# Altium schematic sheet NAND_Flash.SchDoc
size A4; SheetNumber: 3; SheetTotal: 7
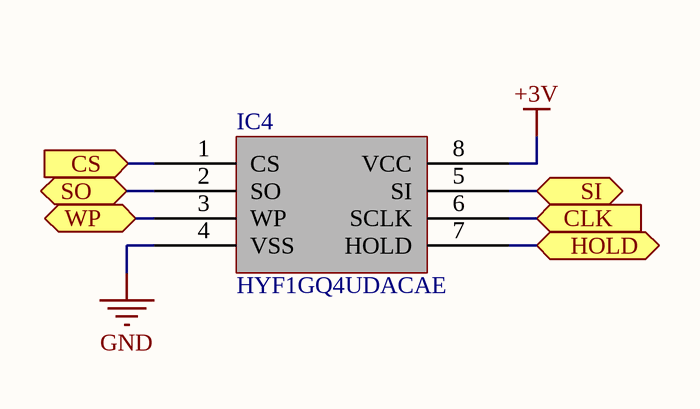
[diagram p0: NAND_Flash.SchDoc]

## Parts
IC4  HYF1GQ4UDACAE  [HeYangTek WSON-8-EP]

## Ports
CLK (in), CS (in), HOLD (bidir), SI (bidir), SO (bidir), WP (bidir)

## Nets
+3V: IC4.8(VCC)
GND: IC4.4(VSS)
CLK: IC4.6(SCLK) ; port CLK
CS: IC4.1(CS) ; port CS
HOLD: IC4.7(HOLD) ; port HOLD
SI: IC4.5(SI) ; port SI
SO: IC4.2(SO) ; port SO
WP: IC4.3(WP) ; port WP

## Library data of the parts
IC4 = HeYangTek HYF1GQ4UDACAE